# EAGLE design IntegratedSensor (EAGLE 6.3)
Menlo Park Innovation LLC Sensor Front End Electronics
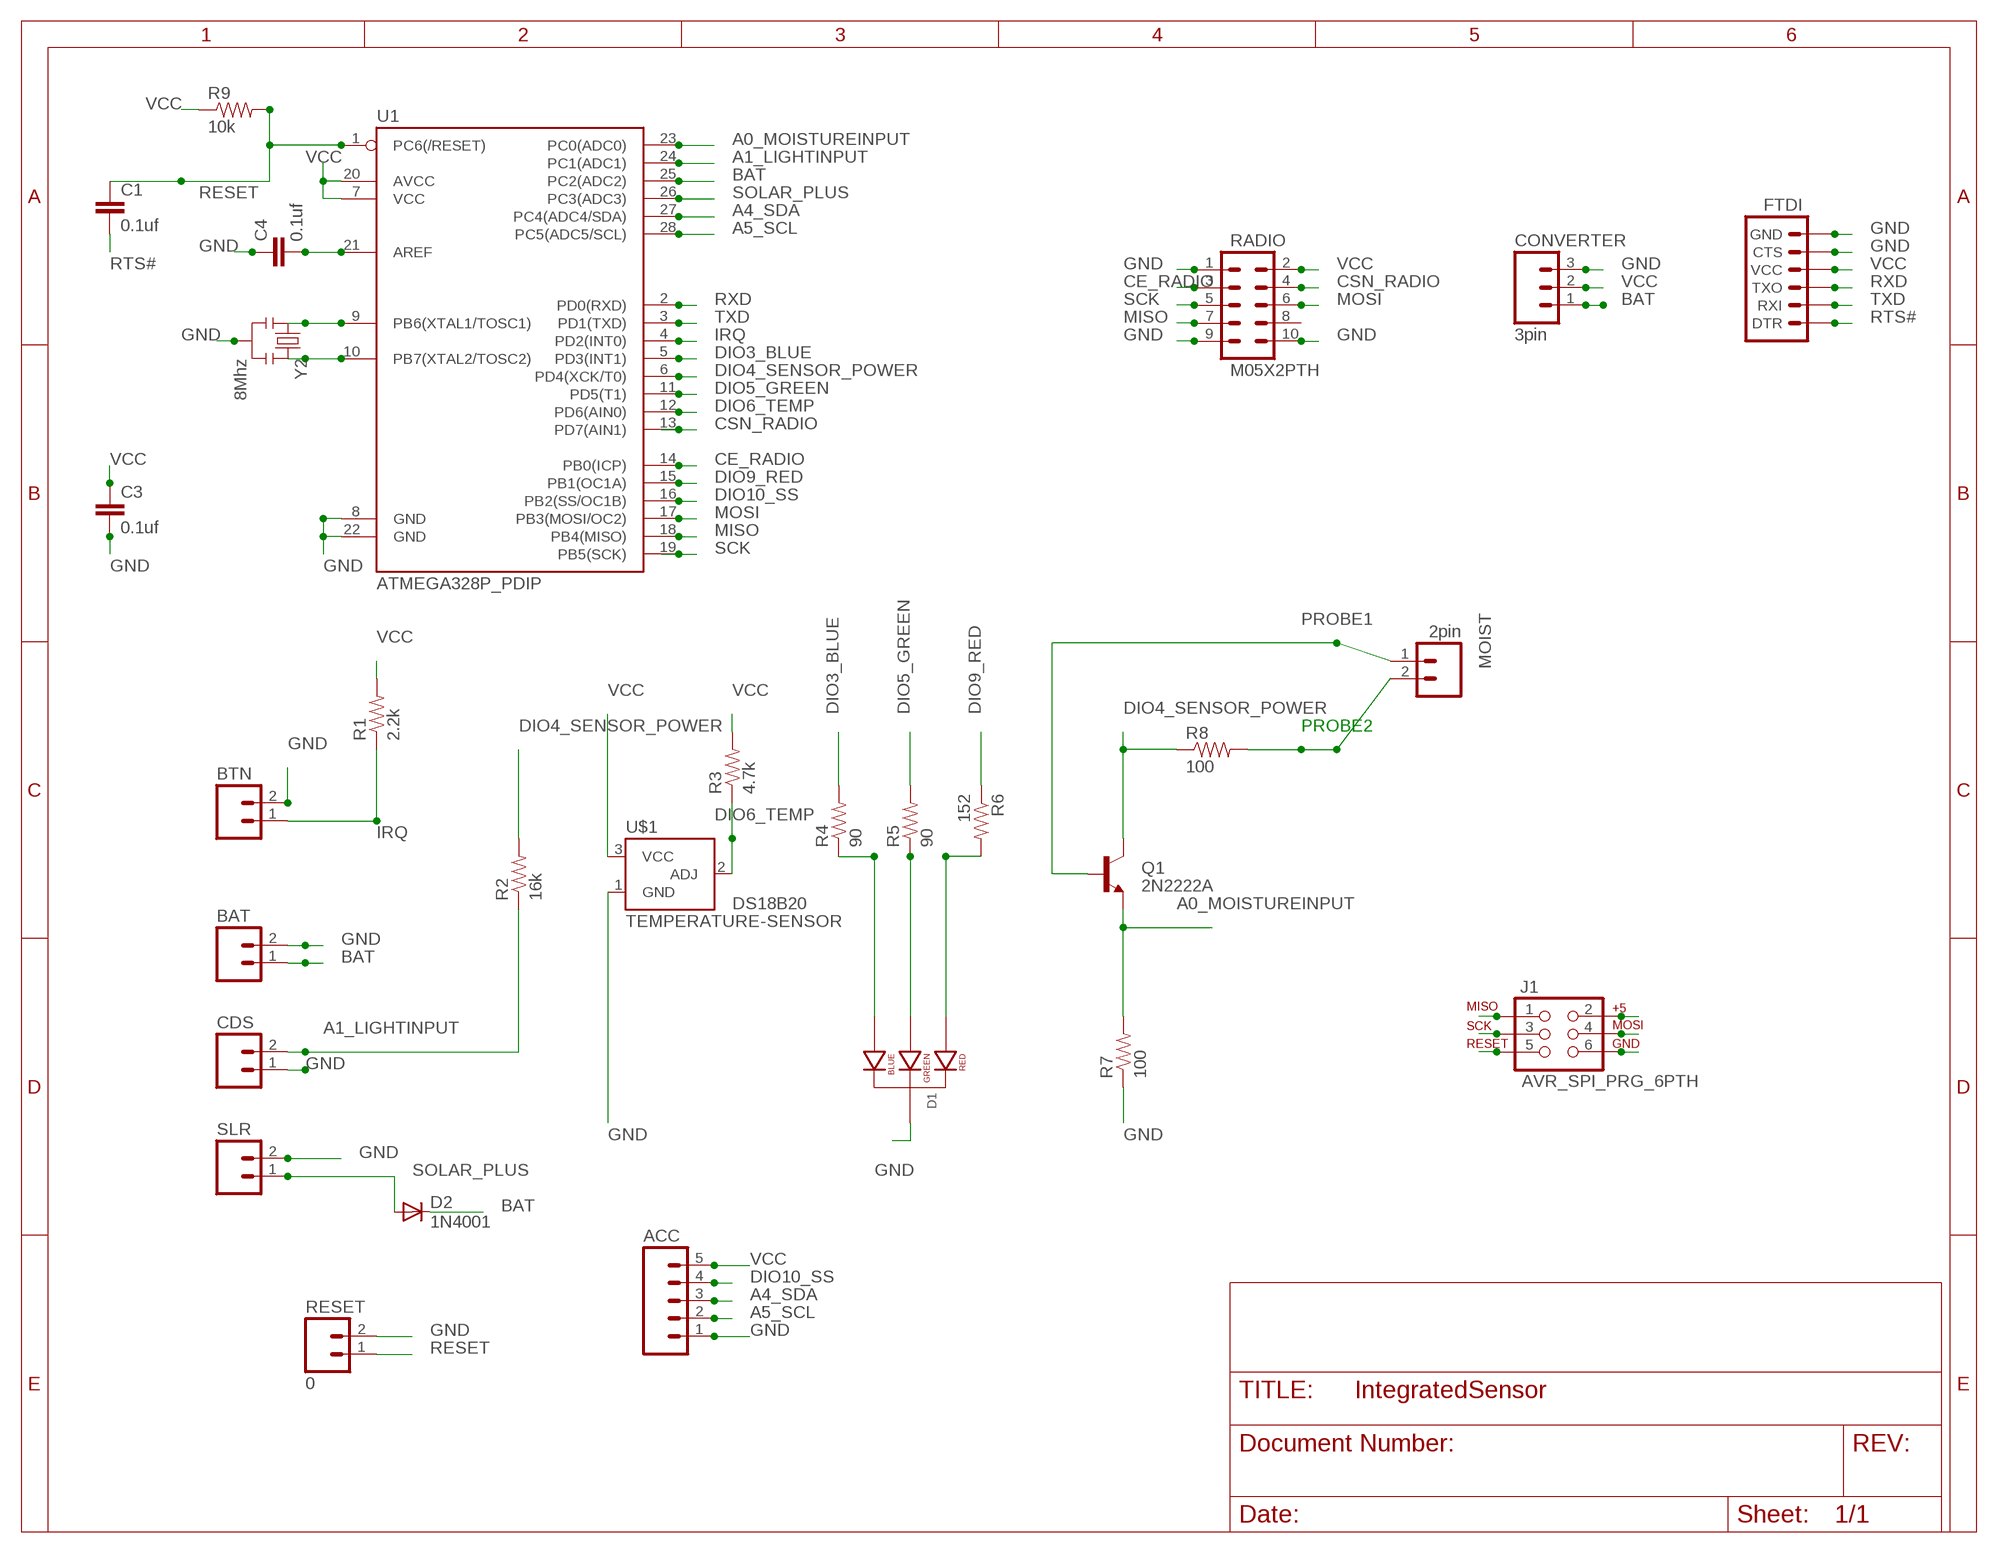
[diagram p0: schematic, sheet 1]

## Parts
ACC  M05PTH  [1X05]
BAT  M02PTH  [1X02]
BTN  M02PTH  [1X02]
C1  0.1uf  CAPPTH  [CAP-PTH-SMALL]
C3  0.1uf  CAPPTH  [CAP-PTH-SMALL]
C4  0.1uf  CAPPTH  [CAP-PTH-SMALL]
CDS  M02PTH  [1X02]
CONVERTER  3pin  M03PTH  [1X03]
D1  LED-RGB-CC-THRUCLEAR  [LED-RGB-THRU]
D2  1N4001  DIODEPTH  [DIODE-1N4001]
FTDI  ARDUINO_SERIAL_PROGRAMPTH  [1X06]
J1  AVR_SPI_PRG_6PTH  [2X3]
MOIST  2pin  M02PTH  [1X02]
Q1  2N2222A  TRANSISTOR_NPNTO-92-AMMO  [TO-92-AMMO]
R1  2.2k  RESISTORPTH-1/6W  [1/6W-RES]
R2  16k  RESISTORPTH-1/6W  [1/6W-RES]
R3  4.7k  RESISTORPTH-1/6W  [1/6W-RES]
R4  90  RESISTORPTH-1/6W  [1/6W-RES]
R5  90  RESISTORPTH-1/6W  [1/6W-RES]
R6  152  RESISTORPTH-1/6W  [1/6W-RES]
R7  100  RESISTORPTH-1/6W  [1/6W-RES]
R8  100  RESISTORPTH-1/6W  [1/6W-RES]
R9  10k  RESISTORPTH-1/6W  [1/6W-RES]
RADIO  M05X2PTH  [AVR_ICSP]
RESET  0  M02PTH  [1X02]
SLR  M02PTH  [1X02]
U1  ATMEGA328P_PDIP  [DIL28-3]
U$1  TEMPERATURE-SENSOR  [TO-92]
Y2  8Mhz  RESONATORPTH  [RESONATOR-PTH]

## Nets
A0_MOISTUREINPUT: Q1.1(E) R7.2 U1.23(PC0(ADC0))
A1_LIGHTINPUT: CDS.2 R2.1 U1.24(PC1(ADC1))
A4_SDA: ACC.3 U1.27(PC4(ADC4/SDA))
A5_SCL: ACC.2 U1.28(PC5(ADC5/SCL))
BAT: BAT.1 CONVERTER.1 D2.C U1.25(PC2(ADC2))
CE_RADIO: RADIO.3 U1.14(PB0(ICP))
CSN_RADIO: RADIO.4 U1.13(PD7(AIN1))
DIO3_BLUE: R4.2 U1.5(PD3(INT1))
DIO4_SENSOR_POWER: Q1.3(C) R2.2 R8.1 U1.6(PD4(XCK/T0))
DIO5_GREEN: R5.2 U1.11(PD5(T1))
DIO6_TEMP: R3.1 U1.12(PD6(AIN0)) U$1.2(ADJ)
DIO9_RED: R6.1 U1.15(PB1(OC1A))
DIO10_SS: ACC.4 U1.16(PB2(SS/OC1B))
GND: ACC.1 BAT.2 BTN.2 C3.2 C4.1 CDS.1 CONVERTER.3 D1.2(CATHODE) FTDI.5(CTS) FTDI.6(GND) J1.6 R7.1 RADIO.1 RADIO.9 RADIO.10 RESET.2 SLR.2 U1.8(GND) U1.22(GND) U$1.1(GND) Y2.2
IRQ: BTN.1 R1.1 U1.4(PD2(INT0))
MISO: J1.1 RADIO.7 U1.18(PB4(MISO))
MOSI: J1.4 RADIO.6 U1.17(PB3(MOSI/OC2))
N$1: D1.4(BLUE_CATHODE) R4.1
N$2: D1.3(GREEN_CATHODE) R5.1
N$3: D1.1(RED_CATHODE) R6.2
N$5: U1.9(PB6(XTAL1/TOSC1)) Y2.1
N$6: U1.10(PB7(XTAL2/TOSC2)) Y2.3
N$8: C4.2 U1.21(AREF)
PROBE1: MOIST.1 Q1.2(B)
PROBE2: MOIST.2 R8.2
RESET: C1.1 J1.5 R9.2 RESET.1 U1.1(PC6(/RESET))
RTS#: C1.2 FTDI.1(DTR)
RXD: FTDI.3(TXO) U1.2(PD0(RXD))
SCK: J1.3 RADIO.5 U1.19(PB5(SCK))
SOLAR_PLUS: D2.A SLR.1 U1.26(PC3(ADC3))
TXD: FTDI.2(RXI) U1.3(PD1(TXD))
VCC: ACC.5 C3.1 CONVERTER.2 FTDI.4(VCC) J1.2 R1.2 R3.2 R9.1 RADIO.2 U1.7(VCC) U1.20(AVCC) U$1.3(VCC)
Unconnected: RADIO.8

## Library data of the parts
ACC = SparkFun-Connectors:M05: Header 5 Standard 5-pin 0.1" header. Use with straight break away headers (SKU : PRT-00116), right angle break away headers (PRT-00553), swiss pins (PRT-00743), machine pins (PRT-00117), and female headers (PRT-00115). Molex polarized connector foot print use with SKU : PRT-08230 with associated crimp pins and housings.
BAT BTN CDS MOIST RESET SLR = SparkFun-Connectors:M02: Header 2 Standard 2-pin 0.1" header. Use with straight break away headers (SKU : PRT-00116), right angle break away headers (PRT-00553), swiss pins (PRT-00743), machine pins (PRT-00117), and female headers (PRT-00115). Molex polarized connector foot print use with SKU : PRT-08233 with associated crimp pins and housings.
C1 C3 C4 = SparkFun-Capacitors:CAP: Capacitor Standard 0603 ceramic capacitor, and 0.1" leaded capacitor.
CONVERTER = SparkFun-Connectors:M03: Header 3 Standard 3-pin 0.1" header. Use with straight break away headers (SKU : PRT-00116), right angle break away headers (PRT-00553), swiss pins (PRT-00743), machine pins (PRT-00117), and female headers (PRT-00115). Molex polarized connector foot print use with SKU : PRT-08232 with associated crimp pins and housings.
D1 = SparkFun-LED-MenloFix:LED-RGB-CC-THRU: RGB Through-hole common cathode LED SparkFun Storefront: COM-00105 (Clear) COM-09264 (Diffuse); PROD_ID: DIO-08418
D2 = SparkFun-DiscreteSemi:DIODE: Diode These are standard reverse protection diodes and small signal diodes. SMA package can handle up to about 1A. SOD-323 can handle about 200mA. What the SOD-323 package when ordering, there are some mfgs out there that are 5-pin packages.
FTDI = SparkFun-Connectors:ARDUINO_SERIAL_PROGRAM: FTDI connector footprints
J1 = SparkFun-Connectors:AVR_SPI_PRG_6: AVR ISP 6 Pin This is the reduced ISP connector for AVR programming. Common on Arduino. This footprint will take up less PCB space and can be used with a 10-pin to 6-pin adapter such as SKU: BOB-08508
Q1 = SparkFun-DiscreteSemi:TRANSISTOR_NPN: Generic NPN BJT. MMBT2222 is the common NPN we use. Double check against datasheet- not all devices are the same!
R1-R9 = SparkFun-Resistors:RESISTOR: Resistor Basic schematic elements and footprints for 0603, 1206, and PTH resistors.
RADIO = SparkFun-Connectors:M05X2: Header 5x2 Standard 10-pin dual row 0.1" header. Commonly used with AVR-ISP. Use with Spark Fun Electronics SKU: PRT-00778
U1 = SparkFun-DigitalIC:ATMEGA328P_PDIP: uC used in the Arduino 32kb flash, 1k EEPROM, 2k SRAM This is the through-hole version of this chip.
U$1 = SparkFun-Sensors:TEMPERATURE-SENSOR: TO-92 temp sensor; PARTNAME: DS18B20
Y2 = SparkFun-FreqCtrl:RESONATOR: Resonator Small SMD resonator. Used, eg, on the Arduino Pro/ Pro Mini boards. 8MHz- XTAL-08895 16MHz- XTAL-08900

## Board
MenloSensor1
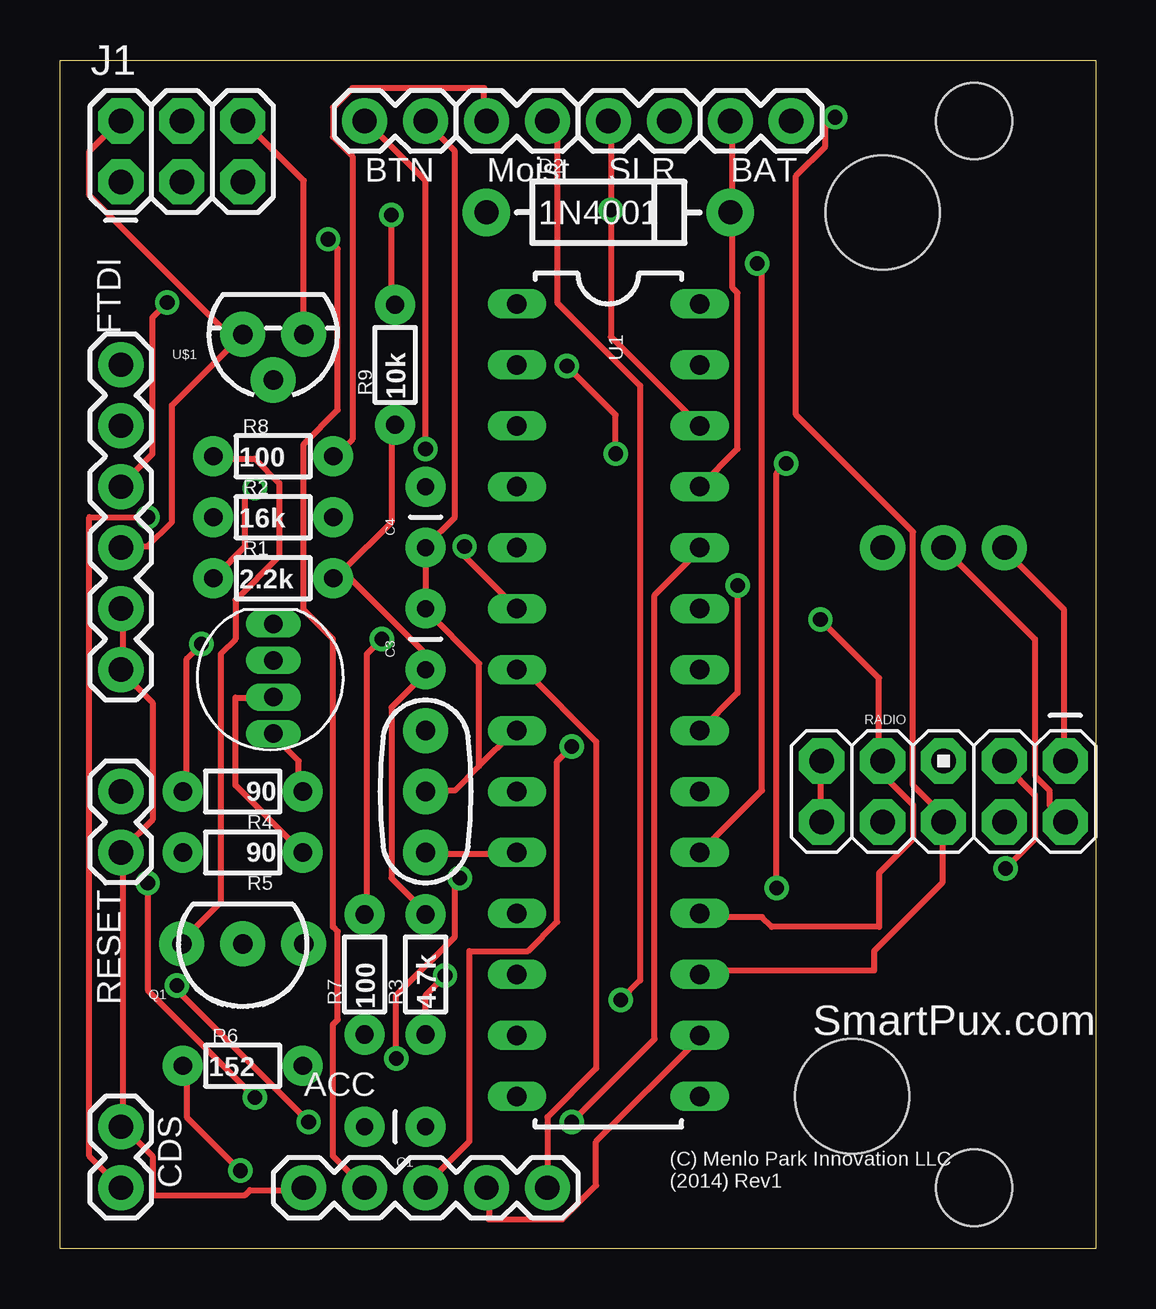
[diagram p1: board, top side]
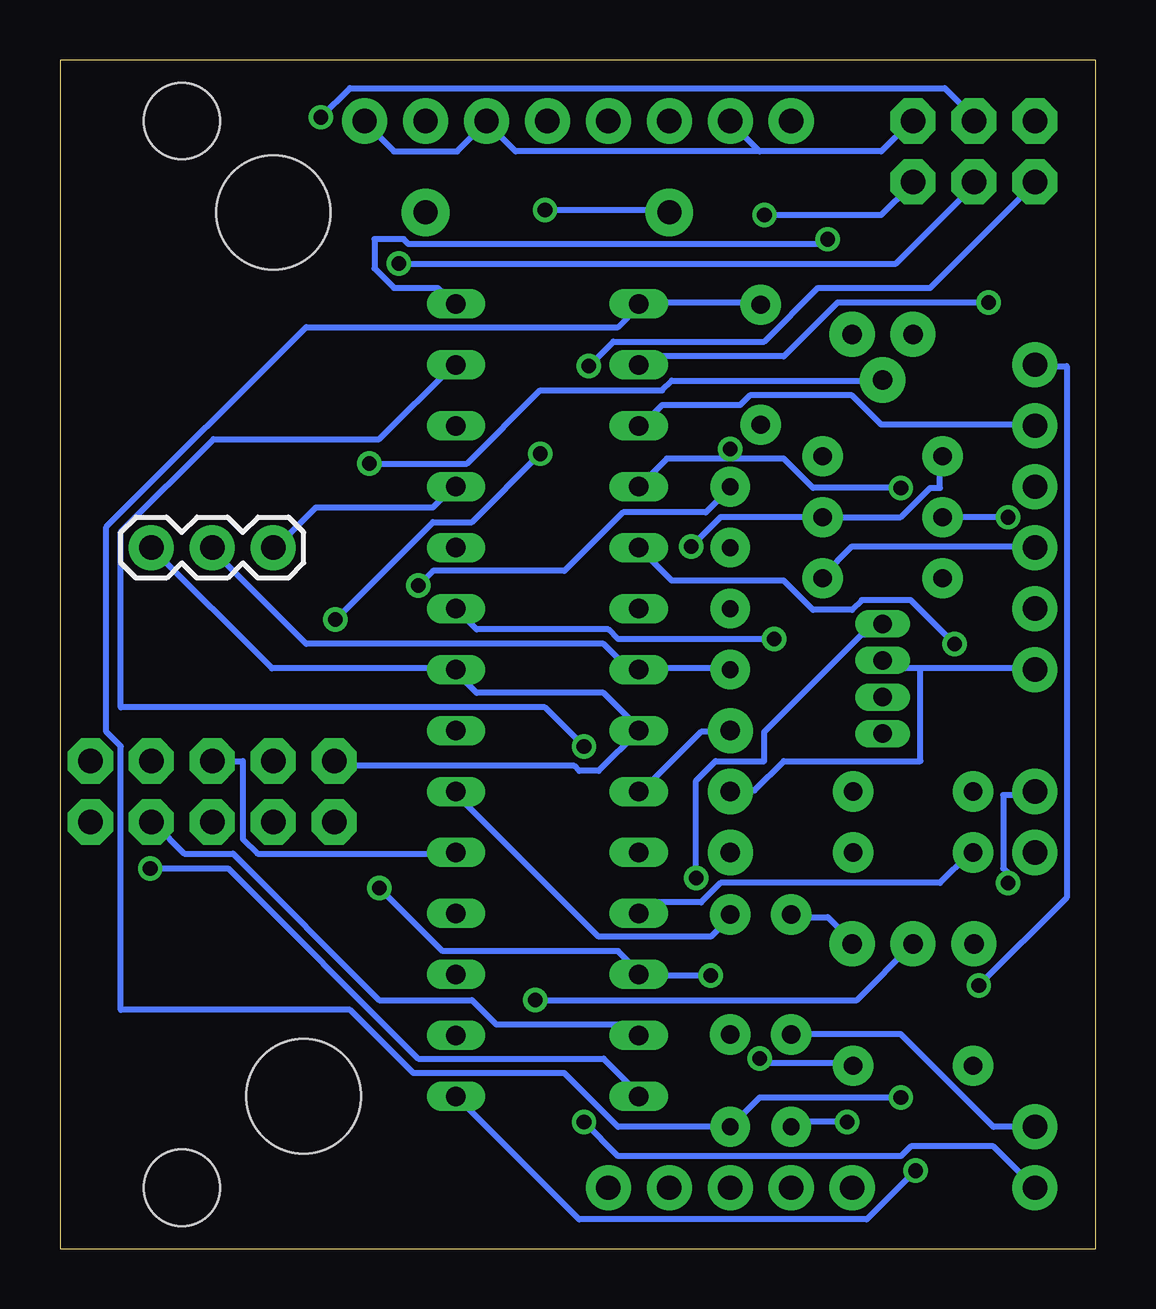
[diagram p2: board, bottom side, seen from below]

Size 43.18 x 49.53 mm. Coordinates in mm from the lower left corner, seen from the top.
Outline: 0,0 0,49.53 43.18,49.53 43.18,0 0,0
Copper layers (1*16): Top 0.035mm / dielectric 1.5mm / Bottom 0.035mm
Design rules "default *": minimum track width 10mil, minimum drill 24mil, track to track 8mil, track to pad 8mil, pad to pad 8mil, via to via 8mil, smd to smd 8mil, copper to edge 40mil, drill to drill 8mil, minimum pad ring 0mil, minimum via ring 8mil, stop-mask expansion 4mil, vias tented up to drill 0mil, thermal gap 10mil

### Footprints (pad centres in the part's own frame; a part is rotated, then mirrored left to right if it is on the bottom)
1X05 = drill 1.016 pad 1.88: 1 0,0; 2 2.54,0; 3 5.08,0; 4 7.62,0; 5 10.16,0
1X02 = drill 1.016 pad 1.88: 1 0,0; 2 2.54,0
CAP-PTH-SMALL = drill 0.7 pad 1.651: 1 0,0; 2 2.54,0
1X03 = drill 1.016 pad 1.88: 1 0,0; 2 2.54,0; 3 5.08,0
LED-RGB-THRU = drill 0.762 pad 0.889 long: 1 1.905,0; 2 0.381,0; 3 -1.143,0; 4 -2.667,0
DIODE-1N4001 = drill 1 pad 1.981: A -5.08,0; C 5.08,0
1X06 = drill 1.016 pad 1.88: 1 0,0; 2 2.54,0; 3 5.08,0; 4 7.62,0; 5 10.16,0; 6 12.7,0
2X3 = drill 1.016 pad 1.88 octagon: 1 0,0; 2 0,2.54; 3 2.54,0; 4 2.54,2.54; 5 5.08,0; 6 5.08,2.54
TO-92-AMMO = drill 0.813 pad 1.88: 1 -2.54,0; 2 0,0; 3 2.54,0
1/6W-RES = drill 0.762 pad 1.676: 1 -2.5,0; 2 2.5,0
AVR_ICSP = drill 1.016 pad 1.88 octagon: 1 -1.27,5.08; 2 1.27,5.08; 3 -1.27,2.54; 4 1.27,2.54; 5 -1.27,0; 6 1.27,0; 7 -1.27,-2.54; 8 1.27,-2.54; 9 -1.27,-5.08; 10 1.27,-5.08
DIL28-3 = drill 0.813 long: 1 -16.51,-3.81; 2 -13.97,-3.81; 3 -11.43,-3.81; 4 -8.89,-3.81; 5 -6.35,-3.81; 6 -3.81,-3.81; 7 -1.27,-3.81; 8 1.27,-3.81; 9 3.81,-3.81; 10 6.35,-3.81; 11 8.89,-3.81; 12 11.43,-3.81; 13 13.97,-3.81; 14 16.51,-3.81; 15 16.51,3.81; 16 13.97,3.81; 17 11.43,3.81; 18 8.89,3.81; 19 6.35,3.81; 20 3.81,3.81; 21 1.27,3.81; 22 -1.27,3.81; 23 -3.81,3.81; 24 -6.35,3.81; 25 -8.89,3.81; 26 -11.43,3.81; 27 -13.97,3.81; 28 -16.51,3.81
TO-92 = drill 0.813 pad 1.88: 1 -1.27,0; 2 0,1.905; 3 1.27,0
DRILL_0.1250 = hole 3.175: 0,0
DRILL_0.1875 = hole 4.762: 0,0
RESONATOR-PTH = drill 0.8 pad 1.88: 1 -2.54,0; 2 0,0; 3 2.54,0

### Placement (x,y rotation side)
ACC  10.16,2.54 0 top
BAT  27.94,46.99 0 top
BTN  12.7,46.99 0 top
C1  15.24,5.08 180 top
C3  15.24,24.13 90 top
C4  15.24,29.21 90 top
CDS  2.54,5.08 270 top
CONVERTER  34.29,29.21 180 bottom
D1  8.89,24.13 90 top
D2  22.86,43.18 0 top
FTDI  2.54,36.83 270 top
J1  2.54,44.45 0 top
MOIST  20.32,46.99 180 top
Q1  7.62,12.7 180 top
R1  8.89,27.94 0 top
R2  8.89,30.48 0 top
R3  15.24,11.43 90 top
R4  7.62,19.05 180 top
R5  7.62,16.51 180 top
R6  7.62,7.62 0 top
R7  12.7,11.43 90 top
R8  8.89,33.02 0 top
R9  13.97,36.83 90 top
RADIO  36.83,19.05 270 top
RESET  2.54,19.05 270 top
SLR  22.86,46.99 0 top
U1  22.86,22.86 270 top
U$1  8.89,38.1 180 top
U$2  [DRILL_0.1250]  38.1,2.54 0 top
U$3  [DRILL_0.1250]  38.1,46.99 0 top
U$4  [DRILL_0.1875]  33.02,6.35 0 top
U$5  [DRILL_0.1875]  34.29,43.18 0 top
Y2  15.24,19.05 270 top

### Tracks (layer width: path | path; a pad name or v marks a point on that pad's centre or on a via)
A0_MOISTUREINPUT  (via drill 0.61)
  Top 0.254: v13.41,25.4 12.8,24.79 12.8,14.02 R7.2
  Bottom 0.254: U1.23 25.81,25.81 20.32,25.81 19.91,25.4 v13.41,25.4 | Q1.1 10.16,12.8 11.18,13.82 12.6,13.82 R7.2
A1_LIGHTINPUT  (via drill 0.61)
  Top 0.254: v21.34,5.28 24.79,8.74 24.79,27.23 26.62,29.06 U1.24 | v3.66,30.48 1.22,30.48 1.22,3.86 CDS.2
  Bottom 0.254: v21.34,5.28 19.91,3.86 8.13,3.86 7.72,4.27 4.27,4.27 CDS.2 | v3.66,30.48 R2.1
A4_SDA  (via drill 0.61)
  Top 0.254: v21.34,20.93 20.73,20.32 20.73,13.61 19.51,12.39 17.07,12.39 17.07,4.47 15.24,2.64 ACC.3
  Bottom 0.254: v21.34,20.93 22.96,22.55 40.64,22.55 40.64,29.87 36.78,33.73 29.87,33.73 26.82,36.78 U1.27
A5_SCL  (via drill 0.61)
  Top 0.254: v11.18,42.06 11.58,41.66 11.58,34.95 10.16,33.53 10.16,26.62 11.38,25.4 11.38,13.41 11.58,13.21 11.58,9.55 11.38,9.35 11.38,3.86 ACC.2
  Bottom 0.254: v11.18,42.06 11.38,41.86 28.65,41.86 28.85,42.06 30.07,42.06 30.07,40.84 29.26,40.03 27.43,40.03 26.82,39.42 U1.28
BAT
  Top 0.254: BAT.1 28.04,46.94 28.04,43.28 D2.C 28.04,43.08 28.04,40.03 28.25,39.83 28.25,33.33 U1.25
  Bottom 0.254: U1.25 26.82,31.7 27.64,30.89 32.51,30.89 34.14,29.26 CONVERTER.1
CE_RADIO  (via drill 0.61)
  Top 0.254: v39.42,15.85 40.64,17.07 40.64,18.9 39.42,20.12 39.42,20.32 RADIO.3
  Bottom 0.254: v39.42,15.85 36.17,15.85 28.25,7.92 20.52,7.92 19.1,6.5 U1.14
CSN_RADIO
  Bottom 0.254: U1.13 19.51,9.35 24.99,9.35 26.01,10.36 29.87,10.36 35.97,16.46 38,16.46 39.22,17.68 RADIO.4
DIO3_BLUE  (via drill 0.61)
  Top 0.254: v5.89,25.2 5.28,24.59 5.28,19.1 R4.2
  Bottom 0.254: U1.5 17.68,27.84 13.01,27.84 11.79,26.62 10.16,26.62 9.75,27.03 7.72,27.03 v5.89,25.2
DIO4_SENSOR_POWER  (via drill 0.61)
  Top 0.254: U1.6 16.87,28.85 v16.87,29.26 | Q1.3 5.08,12.8 6.71,14.43 6.71,24.79 7.32,25.4 7.32,27.03 9.14,28.85 9.14,31.9 8.13,32.92 6.5,32.92 R8.1
  Bottom 0.254: v16.87,29.26 15.65,30.48 R2.2 8.13,30.48 6.91,31.7 6.5,31.7 6.5,32.92 R8.1
DIO5_GREEN
  Bottom 0.254: U1.11 18.9,14.02 18.49,14.43 16.46,14.43 15.65,15.24 6.5,15.24 5.28,16.46 R5.2
DIO6_TEMP  (via drill 0.61)
  Top 0.254: v16.05,11.38 15.24,10.57 R3.1 | v30.28,32.72 29.87,32.31 v29.87,15.04
  Bottom 0.254: v16.05,11.38 18.9,11.38 U1.12 19.1,11.58 19.91,12.39 27.23,12.39 v29.87,15.04 | v30.28,32.72 26.21,32.72 23.16,35.76 18.09,35.76 17.68,36.17 8.94,36.17 U$1.2
DIO9_RED  (via drill 0.61)
  Top 0.254: v7.52,3.25 5.28,5.49 5.28,7.52 R6.1
  Bottom 0.254: U1.15 21.54,1.22 9.55,1.22 v7.52,3.25
DIO10_SS
  Top 0.254: U1.16 26.62,8.74 22.35,4.47 22.35,2.64 20.93,1.22 17.88,1.22 17.88,2.44 ACC.4
GND
  Top 0.254: FTDI.5 2.64,26.62 2.64,24.18 FTDI.6 2.64,23.98 3.86,22.76 3.86,17.88 2.64,16.66 RESET.2 2.64,16.46 2.64,5.08 | 2.64,5.08 3.86,3.86 3.86,2.23 7.72,2.23 7.92,2.44 10.16,2.44 ACC.1 | 2.64,5.08 CDS.1 | U$1.1 10.16,44.5 7.72,46.94 J1.6 | CONVERTER.3 39.42,29.06 41.86,26.62 41.86,20.32 RADIO.1 | RADIO.10 31.7,17.88 31.7,20.32 RADIO.9 | 17.48,20.12 16.46,19.1 15.24,19.1 Y2.2 | 17.48,20.12 18.9,21.54 U1.8 | 17.48,20.12 17.48,24.38 15.24,26.62 C3.2 C4.1 15.24,29.26 16.46,30.48 16.46,45.72 15.24,46.94 BTN.2
  Bottom 0.254: 7.32,24.18 2.64,24.18 FTDI.6 | 7.32,24.18 8.53,24.18 8.74,24.38 D1.2 | CDS.1 4.27,5.08 8.13,8.94 12.6,8.94 R7.1 | 25.4,46.94 26.62,45.72 29.26,45.72 30.48,46.94 BAT.2 | 14.02,45.72 15.24,46.94 BTN.2 | 14.02,45.72 8.94,45.72 7.72,46.94 J1.6 | 25.4,46.94 24.18,45.72 14.02,45.72 | 25.4,46.94 SLR.2 | RADIO.9 31.7,20.32 31.5,20.12 21.74,20.12 21.54,19.91 20.73,19.91 U1.8 19.1,21.74 20.52,23.16 25.81,23.16 26.62,23.98 U1.22 26.82,24.18 34.34,24.18 CONVERTER.3 | 7.32,24.18 7.32,20.32 13.01,20.32 14.22,19.1 15.24,19.1 Y2.2
IRQ  (via drill 0.61)
  Top 0.254: v8.13,31.7 7.72,31.29 7.72,29.26 6.5,28.04 R1.1 | v15.24,33.33 15.24,44.5 12.8,46.94 BTN.1
  Bottom 0.254: U1.4 17.88,32.92 15.24,32.92 | 15.24,32.92 13.01,32.92 11.79,31.7 v8.13,31.7 | 15.24,32.92 v15.24,33.33
MISO  (via drill 0.61)
  Top 0.254: U1.18 26.82,13.82 29.26,13.82 29.67,13.41 34.14,13.41 34.14,15.65 35.56,17.07 35.56,18.49 34.34,19.71 34.34,20.32 RADIO.7 34.14,20.32 34.14,23.77 v31.7,26.21 | v21.13,36.78 23.16,34.75 v23.16,33.12
  Bottom 0.254: v21.13,36.78 20.12,37.8 13.82,37.8 11.58,40.03 6.91,40.03 2.64,44.3 J1.1 | v23.16,33.12 26.01,30.28 27.64,30.28 v31.7,26.21
MOSI  (via drill 0.61)
  Top 0.254: U1.17 26.82,11.58 33.93,11.58 33.93,12.39 36.78,15.24 36.78,17.68 RADIO.6 36.78,17.88 36.78,18.09 35.56,19.3 35.56,29.87 30.68,34.75 30.68,44.7 31.9,45.92 31.9,46.74 v32.31,47.14
  Bottom 0.254: v32.31,47.14 31.09,48.36 6.3,48.36 5.08,47.14 J1.4
N$1
  Top 0.254: D1.4 8.94,21.34 9.96,20.32 9.96,19.1 R4.1
N$2
  Top 0.254: D1.3 8.74,22.96 7.32,22.96 7.32,19.3 9.96,16.66 R5.1
N$3  (via drill 0.61)
  Top 0.254: v16.66,15.44 16.46,15.24 16.46,13.01 14.02,10.57 v14.02,7.92
  Bottom 0.254: v16.66,15.44 16.66,19.51 15.85,20.32 13.82,20.32 13.82,21.54 9.75,25.6 9.35,25.6 8.94,26.01 D1.1 | v14.02,7.92 13.82,7.72 10.16,7.72 R6.2
N$5
  Bottom 0.254: U1.9 18.9,19.1 16.46,21.54 15.24,21.54 Y2.1
N$6
  Top 0.254: U1.10 18.9,16.46 15.24,16.46 Y2.3
N$8  (via drill 0.61)
  Top 0.254: U1.21 28.25,23.16 v28.25,27.64
  Bottom 0.254: v28.25,27.64 27.64,28.25 22.15,28.25 19.71,30.68 16.26,30.68 15.24,31.7 C4.2
PROBE1  (via drill 0.61)
  Top 0.254: v23.37,10.36 24.18,11.18 24.18,35.97 20.73,39.42 20.73,46.53 20.32,46.94 MOIST.1
  Bottom 0.254: Q1.2 9.96,10.36 v23.37,10.36
PROBE2
  Top 0.254: R8.2 11.58,33.12 12.19,33.73 12.19,45.52 11.38,46.33 11.38,47.55 12.19,48.36 17.68,48.36 17.68,47.14 MOIST.2
RESET  (via drill 0.61)
  Top 0.254: v13.82,43.08 13.82,39.42 R9.2 | v8.13,6.3 3.66,10.77 v3.66,15.24
  Bottom 0.254: R9.2 14.02,39.42 18.9,39.42 U1.1 19.1,39.22 19.91,38.41 32.92,38.41 41.25,30.07 41.25,21.54 40.64,20.93 40.64,9.96 31.09,9.96 28.45,7.32 22.15,7.32 19.91,5.08 C1.1 14.02,6.3 v8.13,6.3 | v13.82,43.08 8.94,43.08 7.72,44.3 J1.5 | v3.66,15.24 3.66,15.65 3.86,15.85 3.86,18.9 2.64,18.9 RESET.1
RTS#  (via drill 0.61)
  Top 0.254: v10.36,5.28 4.88,10.77 v4.88,10.97
  Bottom 0.254: v10.36,5.28 12.39,5.28 12.6,5.08 C1.2 | v4.88,10.97 1.22,14.63 1.22,36.78 2.44,36.78 FTDI.1
RXD  (via drill 0.61)
  Top 0.254: v4.47,39.42 3.86,38.81 3.86,33.12 2.64,31.9 FTDI.3
  Bottom 0.254: U1.2 18.69,37.19 13.01,37.19 10.77,39.42 v4.47,39.42
SCK  (via drill 0.61)
  Top 0.254: v29.06,41.05 29.26,40.84 29.26,19.1 U1.19
  Bottom 0.254: RADIO.5 35.56,20.32 35.56,17.07 34.95,16.46 26.82,16.46 U1.19 | v29.06,41.05 8.33,41.05 5.08,44.3 J1.3
SOLAR_PLUS  (via drill 0.61)
  Top 0.254: U1.26 22.96,38 v22.96,43.28 22.96,46.94 SLR.1
  Bottom 0.254: v22.96,43.28 17.88,43.28 D2.A
TXD
  Bottom 0.254: U1.3 18.9,34.34 18.09,35.15 14.83,35.15 14.43,35.56 10.16,35.56 8.94,34.34 2.64,34.34 FTDI.2
VCC
  Top 0.254: 11.79,28.25 13.82,30.28 13.82,34.14 R9.1 | 11.79,28.25 11.58,28.04 R1.2 11.79,28.25 | 7.32,37.8 4.67,35.15 4.67,30.28 3.66,29.26 2.64,29.26 FTDI.4 | 7.32,37.8 U$1.3 7.52,38 | 7.32,37.8 1.22,43.89 1.22,45.72 2.44,46.94 J1.2 | CONVERTER.2 40.64,25.4 40.64,19.71 41.25,19.1 41.25,18.49 41.86,17.88 RADIO.2 | ACC.5 20.32,5.49 22.35,7.52 22.35,21.13 19.51,23.98 19.1,23.98 U1.7 | R3.2 15.24,14.02 13.82,15.44 13.82,22.55 15.24,23.98 C3.1 15.24,24.79 11.79,28.25
  Bottom 0.254: FTDI.4 2.64,29.26 10.16,29.26 11.38,28.04 R1.2 | U1.20 26.62,18.9 20.73,13.01 16.05,13.01 15.24,13.82 R3.2 | C3.1 15.24,24.18 18.9,24.18 U1.7 19.1,24.18 19.51,24.18 20.52,25.2 32.92,25.2 36.78,29.06 CONVERTER.2

### Text on the board
tPlace: BTN | Moist | SLR | BAT | FTDI | RESET | SmartPux.com | ACC | CDS | (C) Menlo Park Innovation LLC / (2014) Rev1